# EAGLE design wemos_weather_station (EAGLE 9.6.2)
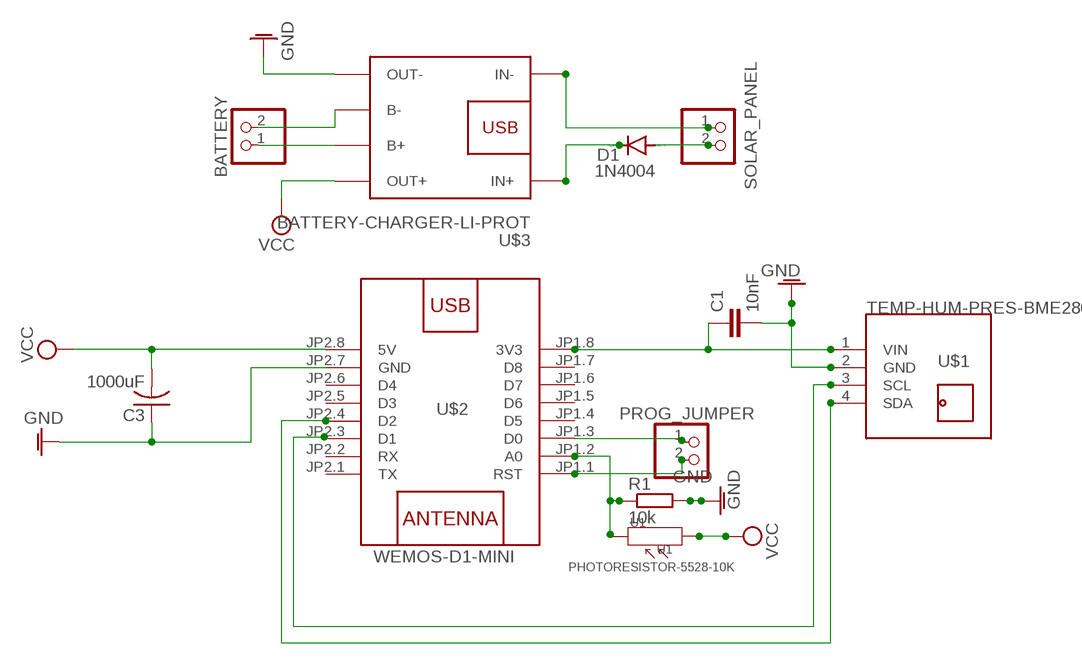
[diagram p0: schematic, sheet 1]

## Parts
BATTERY  PINHD-1X2  [1X02]
C1  10nF  C-EU025-025X050  [C025-025X050]
C3  1000uF  C-US050-024X044  [C050-024X044]
D1  1N4004  [DO41-10]
PROG_JUMPER  PINHD-1X2  [1X02]
R1  10k  R-EU_0204/7  [0204/7]
SOLAR_PANEL  PINHD-1X2  [1X02]
U1  PHOTORESISTOR-5528-10K  PHOTORESISTOR-5528-10K(2P-5.0X4.2MM)  [SNR2-3.0]
U$1  TEMP-HUM-PRES-BME280  [TEMP-HUM-PRES-BME280]
U$2  WEMOS-D1-MINI  [WEMOS-D1-MINI]
U$3  BATTERY-CHARGER-LI-PROT  [BATTERY-CHARGER-LI-PROT]

## Nets
GND: C1.2 C3.1 R1.2 U$1.2(GND) U$2.JP2.7(GND) U$3.OUT-
N$1: SOLAR_PANEL.1 U$3.IN-
N$2: D1.C U$3.IN+
N$3: BATTERY.1 U$3.B+
N$4: BATTERY.2 U$3.B-
N$5: D1.A SOLAR_PANEL.2
N$6: PROG_JUMPER.1 U$2.JP1.3(D0)
N$7: C1.1 U$1.1(VIN) U$2.JP1.8(3V3)
N$8: U$1.4(SDA) U$2.JP2.4(D2)
N$9: U$1.3(SCL) U$2.JP2.3(D1)
N$10: PROG_JUMPER.2 U$2.JP1.1(RST)
N$11: R1.1 U1.2 U$2.JP1.2(A0)
VCC: C3.2 U1.1 U$2.JP2.8(5V) U$3.OUT+
Unconnected: U$2.JP1.4(D5) U$2.JP1.5(D6) U$2.JP1.6(D7) U$2.JP1.7(D8) U$2.JP2.1(TX) U$2.JP2.2(RX) U$2.JP2.5(D3) U$2.JP2.6(D4)

## Library data of the parts
BATTERY PROG_JUMPER SOLAR_PANEL = pinhead:PINHD-1X2: PIN HEADER
C1 = resistor:C-EU: CAPACITOR, European symbol
C3 = resistor:C-US: CAPACITOR, American symbol
D1 = diode:1N4004: DIODE general purpose rectifier, 1 A
R1 = resistor:R-EU_: RESISTOR, European symbol
U1 = Seeed-Sensor:PHOTORESISTOR-5528-10K(2P-5.0X4.2MM): 314020017; MPN: PHOTORESISTOR-5528-10K
U$1 = diy-modules:TEMP-HUM-PRES-BME280: Digital Humidity-Temperature-Pressure Sensor based on BME280 device More information about BME280 device is available here: https://www.bosch-sensortec.com/bst/products/all_products/bme280 Click here to find device on ebay.com <http://www.ebay.com/sch/bme280+breakout>
U$2 = diy-modules:WEMOS-D1-MINI: WEMOS D1 mini: Mini Wi-Fi Board based on ESP-8266 device More details can be found here: https://www.wemos.cc/product/d1-mini.html Click here to find device on ebay.com <http://www.ebay.com/sch/wemos+d1+mini+nodemcu>
U$3 = diy-modules:BATTERY-CHARGER-LI-PROT: Lithium Battery 5V Charger with protection circuit More details available here: http://www.instructables.com/id/DIY-Lithium-ion-Battery-Charger/step4/TP4056-based-lithium-ion-battery-charger-module/ Click here to find device on ebay.com <http://www.ebay.com/sch/tp4056+charger+usb+protection>

## Board
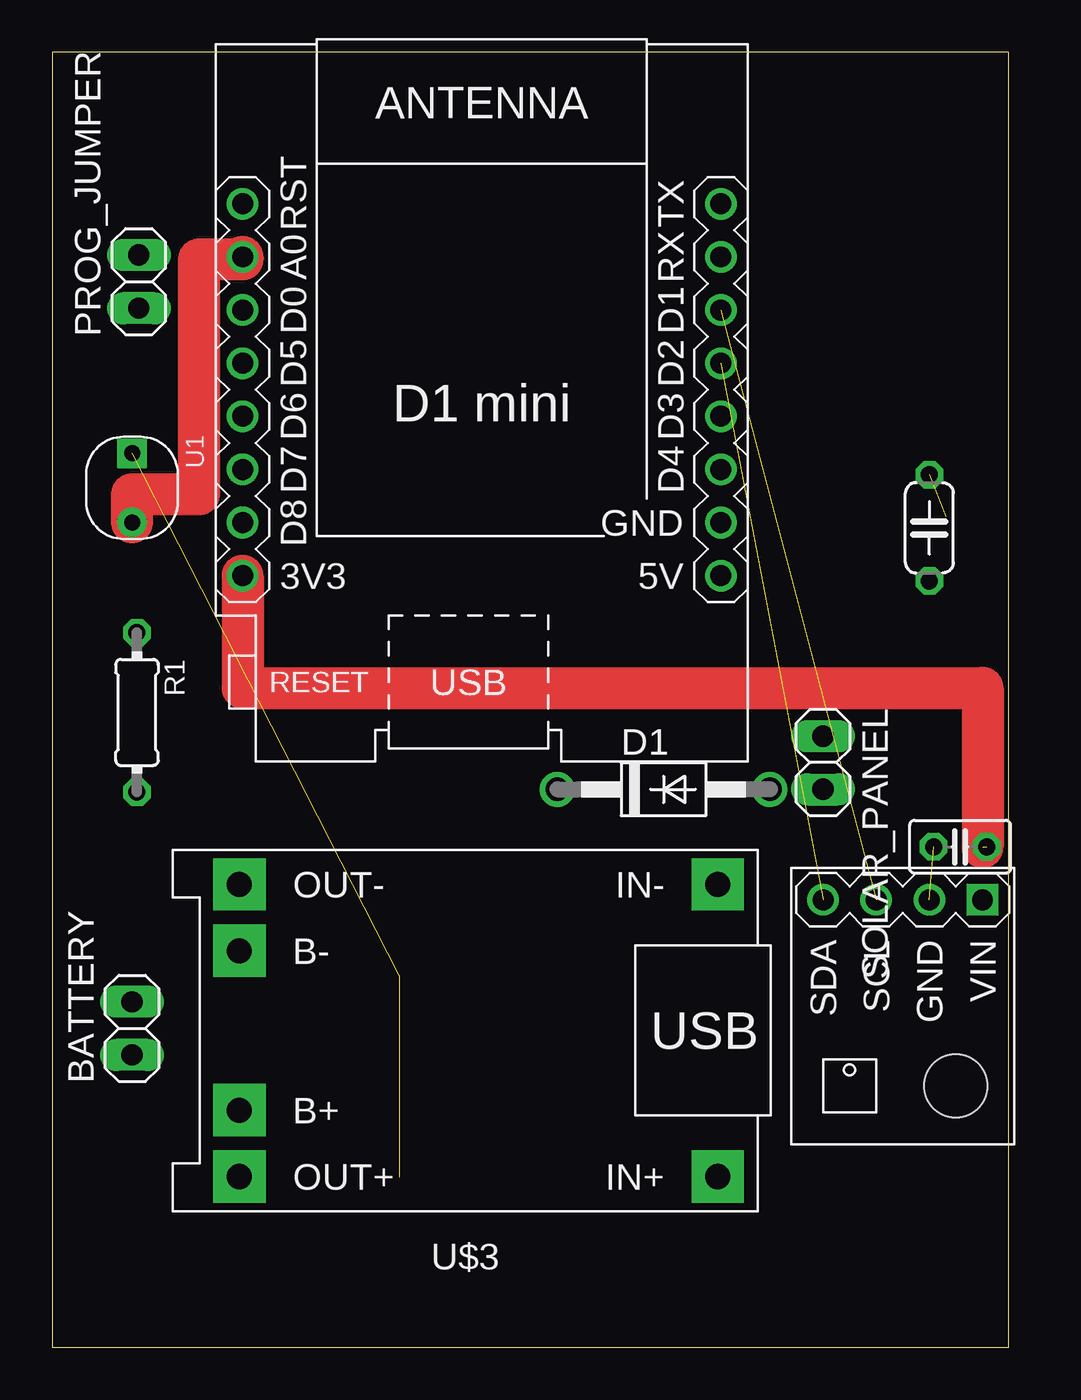
[diagram p1: board, top side]
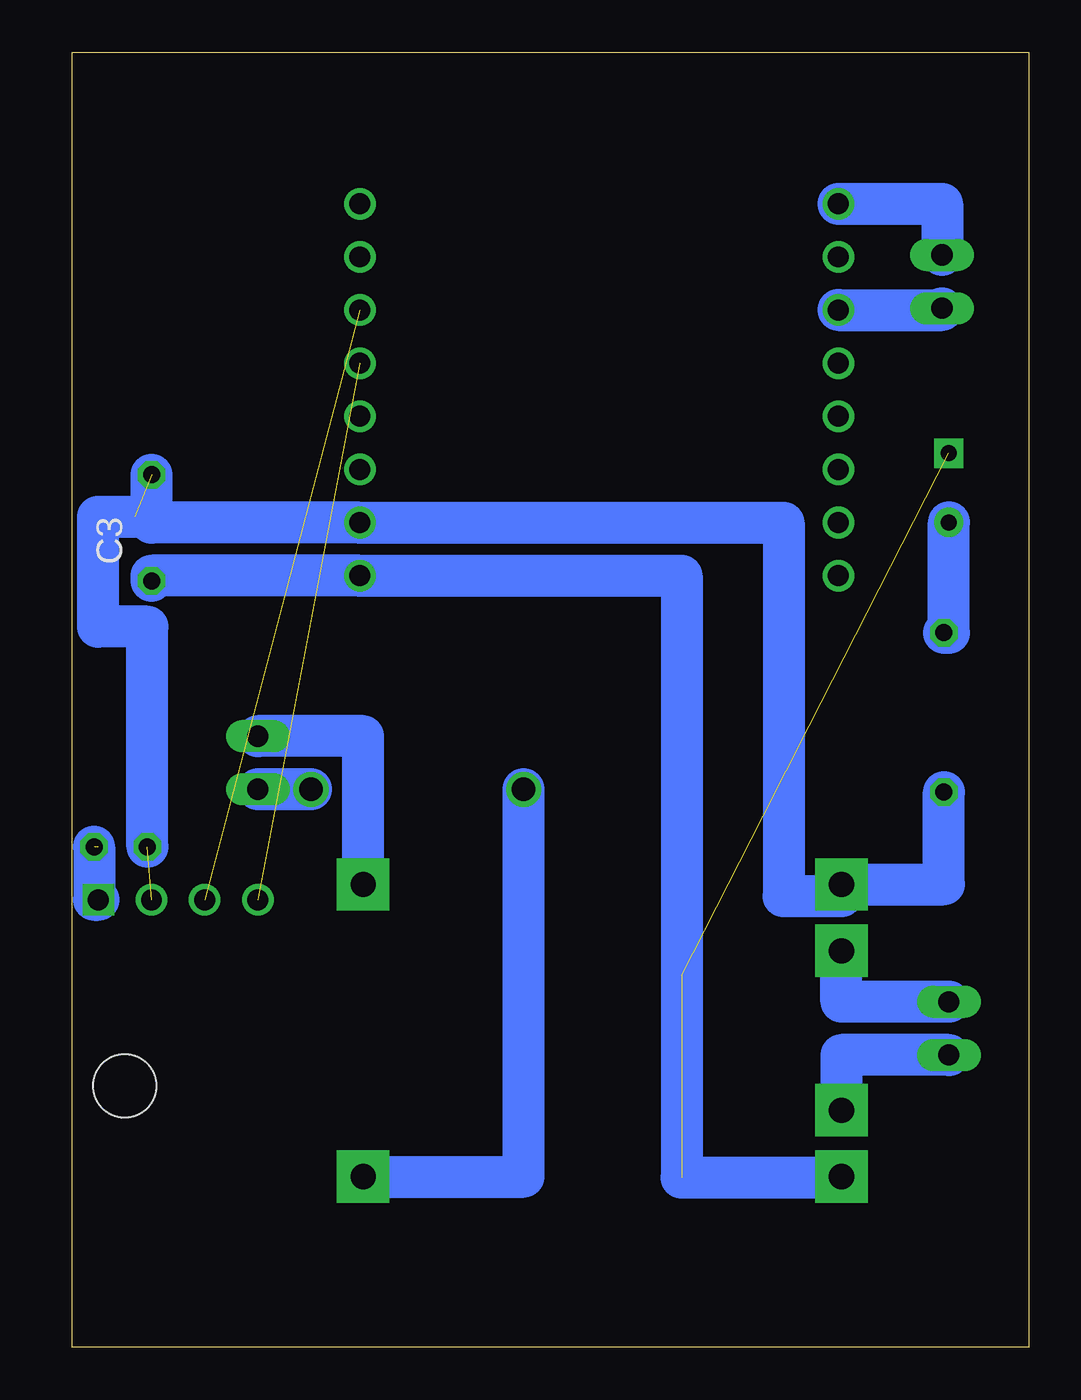
[diagram p2: board, bottom side, seen from below]

Size 45.7 x 61.9 mm. Coordinates in mm from the lower left corner, seen from the top.
Outline: 0,0 45.7,0 45.7,61.9 0,61.9 0,0
Copper layers (1*16): Top 0.035mm / dielectric 1.5mm / Bottom 0.035mm
Design rules "default": minimum track width 6mil, minimum drill 0.35mm, track to track 6mil, track to pad 6mil, pad to pad 6mil, via to via 6mil, smd to smd 6mil, copper to edge 40mil, drill to drill 6mil, minimum pad ring 10mil, minimum via ring 8mil, stop-mask expansion 4mil, vias tented up to drill 0mil, thermal gap 10mil

### Footprints (pad centres in the part's own frame; a part is rotated, then mirrored left to right if it is on the bottom)
1X02 = drill 1.016 long: 1 -1.27,0; 2 1.27,0
C025-025X050 = drill 0.813 octagon: 1 -1.27,0; 2 1.27,0
C050-024X044 = drill 0.813 octagon: 1 -2.54,0; 2 2.54,0
DO41-10 = drill 1.118: A 5.08,0; C -5.08,0
0204/7 = drill 0.813 octagon: 1 -3.81,0; 2 3.81,0
SNR2-3.0 = drill 0.762 pad 1.397 square: 1 -1.651,0 | drill 0.762 pad 1.397: 2 1.651,0
TEMP-HUM-PRES-BME280 = drill 1 square: 1 -5.08,3.81 | drill 1: 2 -5.08,1.27; 3 -5.08,-1.27; 4 -5.08,-3.81 | hole 3: 3.81,2.54
WEMOS-D1-MINI = drill 1: JP1.1 -11.43,9.525; JP1.2 -11.43,6.985; JP1.3 -11.43,4.445; JP1.4 -11.43,1.905; JP1.5 -11.43,-0.635; JP1.6 -11.43,-3.175; JP1.7 -11.43,-5.715; JP1.8 -11.43,-8.255; JP2.1 11.43,9.525; JP2.2 11.43,6.985; JP2.3 11.43,4.445; JP2.4 11.43,1.905; JP2.5 11.43,-0.635; JP2.6 11.43,-3.175; JP2.7 11.43,-5.715; JP2.8 11.43,-8.255
BATTERY-CHARGER-LI-PROT = drill 1.2 pad 2.5 square: B+ 10.795,3.81; B- 10.795,-3.81; IN+ -12.065,6.985; IN- -12.065,-6.985; OUT+ 10.795,6.985; OUT- 10.795,-6.985

### Placement (x,y rotation side)
BATTERY  3.81,15.24 90 top
C1  43.38,23.92 180 top
C3  41.91,39.17 270 top
D1  29.21,26.67 0 top
PROG_JUMPER  4.13,50.94 90 top
R1  4.04,30.34 270 top
SOLAR_PANEL  36.83,27.94 270 top
U1  3.81,41.08 270 top
U$1  40.64,16.31 270 top
U$2  20.52,45.13 0 top
U$3  19.73,15.14 180 top

### Tracks (layer width: path | path; a pad name or v marks a point on that pad's centre or on a via)
GND  (2 unrouted)
  Bottom 2: C3.1 41.91,39.42 U$2.JP2.7 11.7,39.42 11.7,21.57 8.94,21.57 U$3.OUT- 4.04,22.12 R1.2 | C1.2 42.11,34.44 44.46,34.44 44.46,39.71 42.7,39.71
N$1
  Bottom 2: U$3.IN- 31.8,29.21 SOLAR_PANEL.1
N$2
  Bottom 2: U$3.IN+ 24.13,8.16 D1.C
N$3
  Bottom 2: BATTERY.1 8.94,13.97 U$3.B+
N$4
  Bottom 2: BATTERY.2 8.94,16.51 U$3.B-
N$5
  Bottom 2: D1.A SOLAR_PANEL.2
N$6
  Bottom 2: U$2.JP1.3 4.13,49.58 PROG_JUMPER.1
N$7  (1 unrouted)
  Top 2: U$2.JP1.8 9.09,31.51 44.46,31.51 44.46,23.91
  Bottom 2: C1.1 44.65,21.39 U$1.1
N$8  (1 unrouted)
N$9  (1 unrouted)
N$10
  Bottom 2: U$2.JP1.1 4.13,54.66 PROG_JUMPER.2
N$11
  Top 2: U1.2 3.81,40.78 7.01,40.78 7.01,51.99 7.02,51.99 9.09,51.99 U$2.JP1.2
  Bottom 2: R1.1 3.81,34.15 U1.2
VCC  (2 unrouted)
  Bottom 2: C3.2 41.91,36.88 U$2.JP2.8 16.58,36.88 16.58,8.12 8.94,8.12 U$3.OUT+